# Altium schematic sheet 2-MCU.schdoc
size 300 x 219 mm
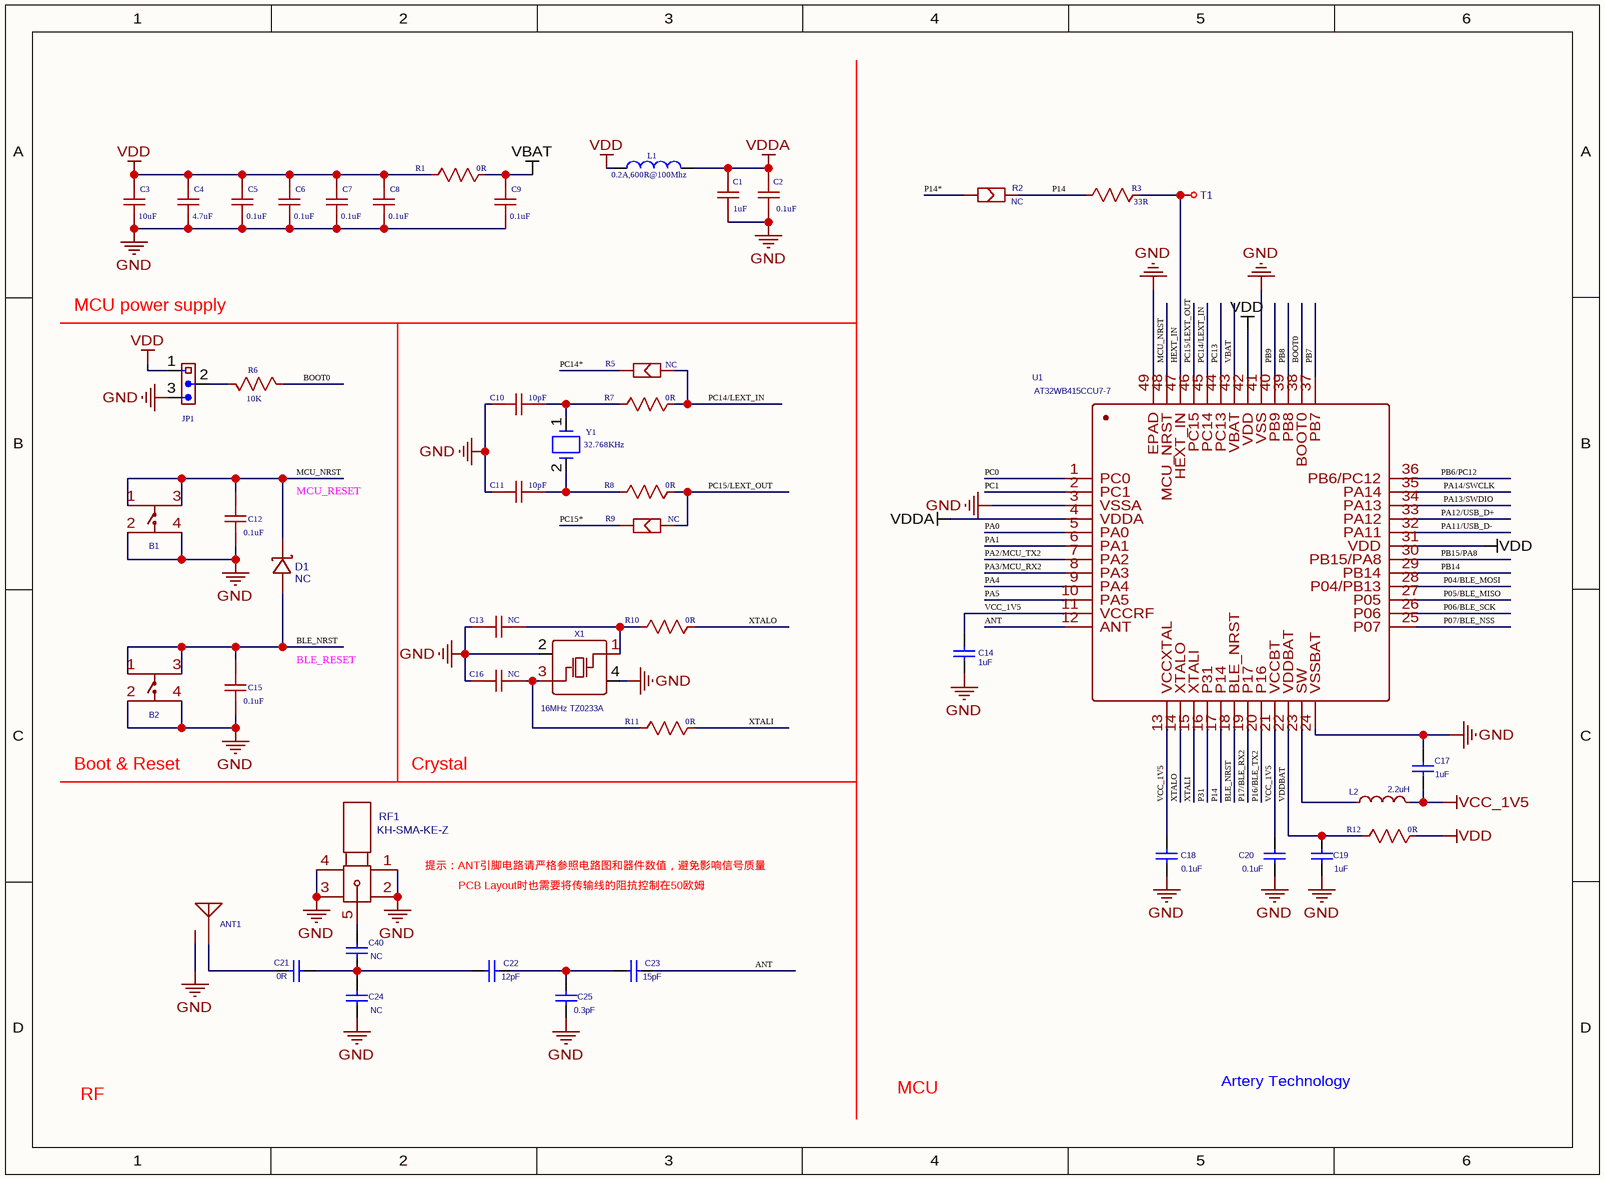
[diagram p0: 2-MCU.schdoc]

## Parts
ANT1  AN2051-245  [2.4G_PIFA_ANT_1.0MM_PCB]  (value not drawn)
B1  贴片按键6*6*5 黑色  [SW-SMD_4P-L6.0-W6.0-P4.50-LS9.0]  (value not drawn)
B2  贴片按键6*6*5 黑色  [SW-SMD_4P-L6.0-W6.0-P4.50-LS9.0]  (value not drawn)
C1  1uF  [0603_C-M]
C2  0.1uF  [0603_C-M]
C3  10uF  [0603_C-M]
C4  4.7uF  [0603_C-M]
C5  0.1uF  [0603_C-M]
C6  0.1uF  [0603_C-M]
C7  0.1uF  [0603_C-M]
C8  0.1uF  [0603_C-M]
C9  0.1uF  [0603_C-M]
C10  10pF  [0603_C-M]
C11  10pF  [0603_C-M]
C12  0.1uF  [0603_C-M]
C13  NC  [0603_C-M]
C14  1uF  [0603_C-M]
C15  0.1uF  [0603_C-M]
C16  NC  [0603_C-M]
C17  1uF  [0603_C-M]
C18  0.1uF  [0603_C-M]
C19  1uF  [0603_C-M]
C20  0.1uF  [0603_C-M]
C21  0R  [C0402]
C22  12pF  [C0402]
C23  15pF  [C0402]
C24  NC  [C0402]
C25  0.3pF  [C0402]
C40  NC  [C0402]
D1  NC  [SOD-323_L1.8-W1.3-LS2.5-RD]
JP1  Header 1x3  [HEADER 1X3]  (value not drawn)
L1  0.2A,600R@100Mhz  [0603_L]
L2  2.2uH  [L0805]
R1  0R  [0603_R-M]
R2  NC  [SB-PAD]
R3  33R  [0603_R-M]
R5  NC  [SB-PAD]
R6  10K  [0603_R-M]
R7  0R  [0603_R-M]
R8  0R  [0603_R-M]
R9  NC  [SB-PAD]
R10  0R  [0603_R-M]
R11  0R  [0603_R-M]
R12  0R  [0603_R-M]
RF1  KH-SMA-KE-Z  [SMA-TH_KH-SMA-KE-Z]
T1  Testpoint1  [PAD1]  (value not drawn)
U1  AT32WB415CCU7-7  [QFN-48_L7.0-W7.0-P0.50-TL-EP5.4]
X1  16MHz TZ0233A  [OSC-SMD_4P-L3.2-W2.5-BL-OXETDLJANF-0.032768MHZ]
Y1  32.768KHz  [XTAL_SOP - FC-12M]

## Nets
GND: ANT1.2 B1.2 B1.4 B2.2 B2.4 C1.1 C2.1 C3.2 C4.2 C5.2 C6.2 C7.2 C8.2 C9.2 C10.1 C11.1 C12.1 C13.1 C14.1 C15.1 C16.1 C17.1 C18.2 C19.2 C20.1 C24.2 C25.2 JP1.3 RF1.1 RF1.2 RF1.3 RF1.4 U1.3(VSSA) U1.24(VSSBAT) U1.41(VSS) U1.49(EPAD) X1.2(GND) X1.4(GND)
VBAT: C9.1 R1.1 U1.43(VBAT)
VCC_1V5: C14.2 C17.2 C18.1 C20.2 L2.2 U1.11(VCCRF) U1.13(VCCXTAL) U1.21(VCCBT)
VDD: C3.1 C4.1 C5.1 C6.1 C7.1 C8.1 JP1.1 L1.1 R1.2 R12.1 U1.31(VDD) U1.42(VDD)
VDDA: C1.2 C2.2 L1.2 U1.4(VDDA)
ANT: C23.1 U1.12(ANT)
BLE_NRST: B2.1 B2.3 C15.2 D1.2(A) U1.18(BLE_NRST)
BOOT0: R6.2 U1.38(BOOT0)
HEXT_IN: R3.1 T1.1 U1.47(HEXT_IN)
MCU_NRST: B1.1 B1.3 C12.2 D1.1(K) U1.48(MCU_NRST)
P04/BLE_MOSI: U1.28(P04/PB13)
P05/BLE_MISO: U1.27(P05)
P06/BLE_SCK: U1.26(P06)
P07/BLE_NSS: U1.25(P07)
P14: R2.2 R3.2 U1.17(P14)
P14*: R2.1
P16/BLE_TX2: U1.20(P16)
P17/BLE_RX2: U1.19(P17)
P31: U1.16(P31)
PA0: U1.5(PA0)
PA1: U1.6(PA1)
PA2/MCU_TX2: U1.7(PA2)
PA3/MCU_RX2: U1.8(PA3)
PA4: U1.9(PA4)
PA5: U1.10(PA5)
PA11/USB_D-: U1.32(PA11)
PA12/USB_D+: U1.33(PA12)
PA13/SWDIO: U1.34(PA13)
PA14/SWCLK: U1.35(PA14)
PB6/PC12: U1.36(PB6/PC12)
PB7: U1.37(PB7)
PB8: U1.39(PB8)
PB9: U1.40(PB9)
PB14: U1.29(PB14)
PB15/PA8: U1.30(PB15/PA8)
PC0: U1.1(PC0)
PC1: U1.2(PC1)
PC13: U1.44(PC13)
PC14*: R5.2
PC14/LEXT_IN: R5.1 R7.1 U1.45(PC14)
PC15*: R9.2
PC15/LEXT_OUT: R8.1 R9.1 U1.46(PC15)
VDDBAT: C19.1 R12.2 U1.22(VDDBAT)
XTALI: R11.1 U1.15(XTALI)
XTALO: R10.1 U1.14(XTALO)
NetANT1_1: ANT1.1(ANT) C21.1
NetC10_2: C10.2 R7.2 Y1.1
NetC11_2: C11.2 R8.2 Y1.2
NetC13_2: C13.2 R10.2 X1.1(OSC1)
NetC16_2: C16.2 R11.2 X1.3(OSC2)
NetC21_2: C21.2 C22.2 C24.1 C40.2
NetC22_1: C22.1 C23.2 C25.1
NetC40_1: C40.1 RF1.5
NetJP1_2: JP1.2 R6.1
NetL2_1: L2.1 U1.23(SW)

## Notes on the sheet
- MCU power supply
- MCU_RESET
- BLE_RESET
- Boot & Reset
- Crystal
- 提示：ANT引脚电路请严格参照电路图和器件数值，避免影响信号质量
- PCB Layout时也需要将传输线的阻抗控制在50欧姆
- RF
- MCU
- Artery Technology

## Library data of the parts
ANT1 = AN2051-245: BOM_Manufacturer: Rainsun; BOM_Paste Type: expand; BOM_Supplier: LCSC; BOM_Manufacturer Part: AN2051-245; BOM_Supplier Part: C99727; spicePre: L; spiceSymbolName: AN2051-245
B1 B2 = 贴片按键6*6*5 黑色: BOM_Manufacturer: Korean Hroparts Elec; BOM_Manufacturer Part: K2-1102SP-C3SC-04; Contributor: LCSC; BOM_Paste Type: expand; BOM_Supplier: LCSC; BOM_Supplier Part: C707347; spicePre: S; spiceSymbolName: K2-1102SP-C3SC-04
C1 = 1uF: nameAlias: Value(F); Contributor: LCEDA_Lib; spicePre: C; spiceSymbolName: C_0603_US
C2 C5-C9 C12 C15 = 0.1uF: nameAlias: Value(F); Contributor: LCEDA_Lib; spicePre: C; spiceSymbolName: C_0603_US
C3 = 10uF: nameAlias: Value(F); Contributor: LCEDA_Lib; spicePre: C; spiceSymbolName: C_0603_US
C4 = 4.7uF: nameAlias: Value(F); Contributor: LCEDA_Lib; spicePre: C; spiceSymbolName: C_0603_US
C10 C11 = 10pF: nameAlias: Value(F); Contributor: LCEDA_Lib; spicePre: C; spiceSymbolName: C_0603_US
C13 C16 = NC: nameAlias: Value(F); Contributor: LCEDA_Lib; spicePre: C; spiceSymbolName: C_0603_US
D1 = NC: BOM_Manufacturer Part: B5819WS; BOM_Manufacturer: MDD; BOM_Supplier: LCSC; BOM_Supplier Part: C64886; BOM_JLCPCB Part Class: Extended Part; spicePre: D; spiceSymbolName: B5819WS
L1 = 0.2A,600R@100Mhz: Contributor: twb17; spicePre: L; spiceSymbolName: Bead_0603
L2 = 2.2uH: BOM_Manufacturer Part: MPH201210S2R2MT; BOM_Manufacturer: Sunlord; nameAlias: Inductance; BOM_Paste Type: expand; BOM_Supplier: LCSC; BOM_Supplier Part: C55755; spicePre: L; spiceSymbolName: MPH201210S2R2MT
R1 R7 R8 R10-R12 = 0R: nameAlias: Value(Ω); Contributor: LCEDA_Lib; spicePre: R; spiceSymbolName: R_0603_US
R2 R5 R9 = NC: Contributor: twb17; spicePre: R; spiceSymbolName: Solder bridge
R3 = 33R: nameAlias: Value(Ω); Contributor: LCEDA_Lib; spicePre: R; spiceSymbolName: R_0603_US
R6 = 10K: nameAlias: Value(Ω); Contributor: LCEDA_Lib; spicePre: R; spiceSymbolName: R_0603_US
RF1 = KH-SMA-KE-Z: BOM_Manufacturer: Shenzhen Kinghelm Elec; Contributor: LCSC; BOM_Supplier: LCSC; BOM_Supplier Part: C504007; BOM_Manufacturer Part: KH-SMA-KE-Z; BOM_JLCPCB Part Class: Extended Part; spicePre: R; spiceSymbolName: KH-SMA-KE-Z
T1 = Testpoint1: Contributor: twb17; spicePre: T; spiceSymbolName: Testpoint1
U1 = AT32WB415CCU7-7: Contributor: twb17; BOM_Supplier: ARTERY; spicePre: U; spiceSymbolName: AT32WB415CCU7-7
X1 = 16MHz TZ0233A: BOM_Manufacturer: Yangxing Tech; BOM_Manufacturer Part: X503216MSB4SI; nameAlias: Frequency; Contributor: LCSC; BOM_Paste Type: expand; BOM_Supplier: LCSC; BOM_Supplier Part: C112586; spicePre: X; spiceSymbolName: X503216MSB4SI
Y1 = 32.768KHz: Contributor: twb17; spicePre: Y; spiceSymbolName: 32.768KHz,CRY,30PPM,Size_3X8